# Altium schematic sheet Actuators.SchDoc: =Project Title
size A4; Author: Mohamat Eirban Ali; DocumentNumber: 4; Revision: 1; SheetNumber: 3; SheetTotal: 4
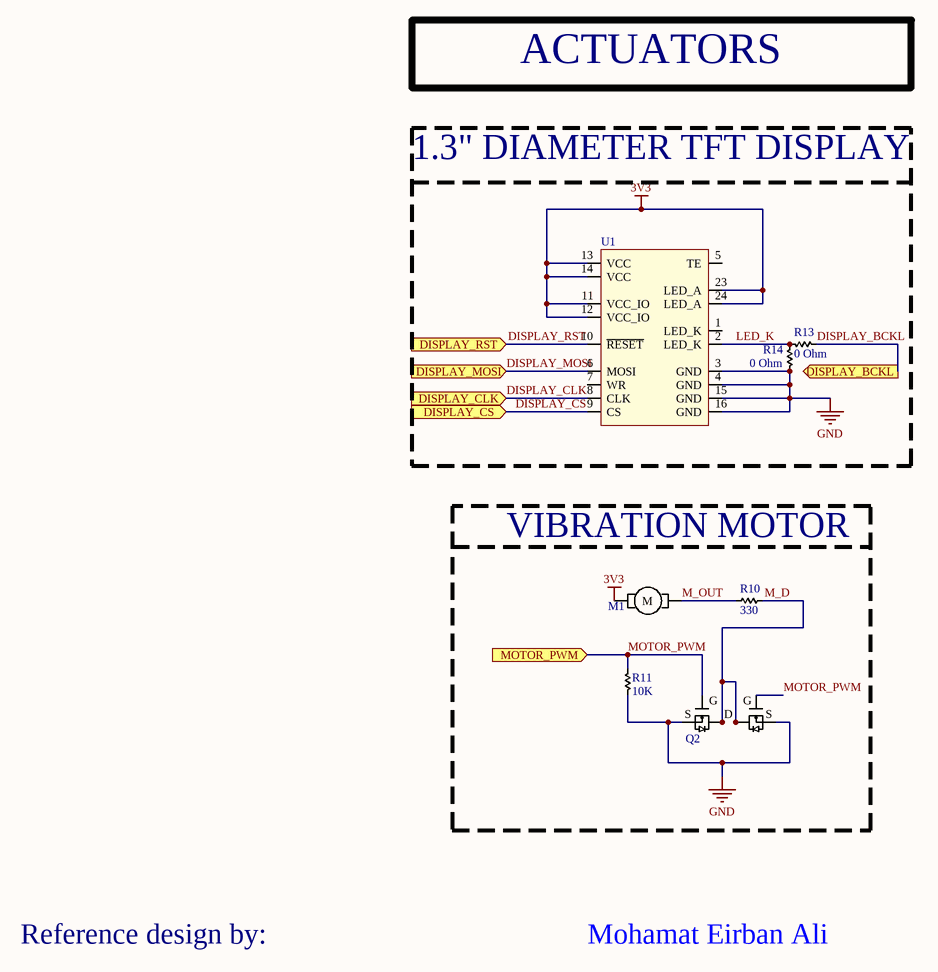
[diagram p0: Actuators.SchDoc]

## Parts
M1  (no value)  [C0720B001F]
Q2  (no value)  [ECH8693R-TL-W]
R10  330  [RES_0603_HIGH]
R11  10K  [RES_0603_HIGH]
R13  0 Ohm  [RES_0603_HIGH]
R14  0 Ohm  [RES_0603_HIGH]
U1  (no value)  [AML130A2402A]

## Blocks framed on the sheet
1.3" DIAMETER TFT DISPLAY: R13 R14 U1
VIBRATION MOTOR: M1 Q2 R10 R11

## Ports
DISPLAY_BCKL (out), DISPLAY_CLK (in), DISPLAY_CS (in), DISPLAY_MOSI (in), DISPLAY_RST (in), MOTOR_PWM (in)

## Nets
3V3: M1.1 U1.11(VCC_IO) U1.12(VCC_IO) U1.13(VCC) U1.14(VCC) U1.23(LED_A) U1.24(LED_A)
GND: Q2.1(S1) Q2.3(S2) R11.1 R14.2 U1.3(GND) U1.4(GND) U1.15(GND) U1.16(GND)
DISPLAY_BCKL: R13.1 ; port DISPLAY_BCKL
DISPLAY_CLK: U1.8(CLK) ; port DISPLAY_CLK
DISPLAY_CS: U1.9(CS) ; port DISPLAY_CS
DISPLAY_MOSI: U1.6(MOSI) ; port DISPLAY_MOSI
DISPLAY_RST: U1.10(~{RESET}) ; port DISPLAY_RST
LED_K: R13.2 R14.1 U1.2(LED_K)
M_D: Q2.5(D) Q2.6(D) Q2.7(D) Q2.8(D) R10.2
M_OUT: M1.2 R10.1
MOTOR_PWM: Q2.2(G1) Q2.4(G2) R11.2 ; port MOTOR_PWM

Not connected (* = marked no-connect by the designer): U1 1(LED_K) 5(TE) 7(WR)

## Notes on the sheet
- ACTUATORS
- Reference design by:
- Mohamat Eirban Ali
- Title
- Size:
- Date:
- A4
- Number:
- Time:
- Revision:
- Sheet
- of
- File:
- (in symbol C0720B001F) M
- (in symbol ECH8693R-TL-W) G; S

## Library data of the parts
M1 = C0720B001F: DC Motor Vibration, ERM 10000 RPM 3VDC; Manufacturer 1: Jinlong Machinery & Electronics; Manufacturer Part Number 1: Z4FC1B1301781; Supplier 1: Digi-Key; Supplier Part Number 1: 1670-1011-1-ND; Stock 1: 12491; Pricing 1: 1=3.49000, 5=3.30200, 10=3.21000, 25=3.11840, 50=2.84300, 100=2.56800, 250=2.47624, 500=2.43956 (USD); RoHS: Yes; Min Operating Temperature: -20°C; Max Operating Temperature: 70°C; Termination: SMD/SMT; RPM: 10000RPM; ComponentLink1URL: http://www.vibration-motor.com/products/download/Z4FC1B1301781.pdf?src-supplier=Digi-Key; ComponentLink1Description: http://www.vibration-motor.com/products/download/Z4FC1B1301781.pdf?src-supplier=Digi-Key
Q2 = ECH8693R-TL-W: Mosfet Array 2 N-Channel (Dual) Common Drain 24V 14A 1.4W Surface Mount SOT-28FL/ECH8; Manufacturer 1: ON Semiconductor; Rise Time: 525ns; Rds On Max: 7mR; Turn-On Delay Time: 545ns; Turn-Off Delay Time: 18650ns; Fall Time: 22200ns; Gate to Source Voltage (Vgs): 12.5V; Number of Channels: 2; Supplier 1: Digi-Key; Supplier Part Number 1: ECH8693R-TL-WOSCT-ND; Manufacturer Part Number 1: ECH8693R-TL-W; Stock 1: 2348; Pricing 1: 1=0.58000, 10=0.49500, 100=0.36940, 500=0.29028, 1000=0.22430 (USD); RoHS: Yes; Mount: Surface Mount; Case/Package: SMD/SMT; Number of Pins: 8; Contact Plating: Tin; Min Operating Temperature: -55°C; Max Operating Temperature: 150°C; Packaging: Tape and Reel; Drain to Source Voltage (Vdss): 24V; Continuous Drain Current (ID): 14A; Max Power Dissipation: 1.4W; Drain to Source Breakdown Voltage: 24V; Drain to Source Resistance: 7mR; Package Quantity: 3000; FET Type: 2 N-Channel; Radiation Hardening: No; Lead Free: Lead Free; ComponentLink1URL: https://datasheet.ciiva.com/30022/ech8693r-d-30022230.pdf?src-supplier=Avnet; ComponentLink1Description: https://datasheet.ciiva.com/30022/ech8693r-d-30022230.pdf?src-supplier=Avnet
R10 = Resistor_0603_2: 0603 Resistor
R11 = Resistor_0603_3: 0603 Resistor
R13 R14 = Resistor_0603_5: 0603 Resistor
U1 = AML130A2402A: AML130A2402A Round 1.3" TFT Display